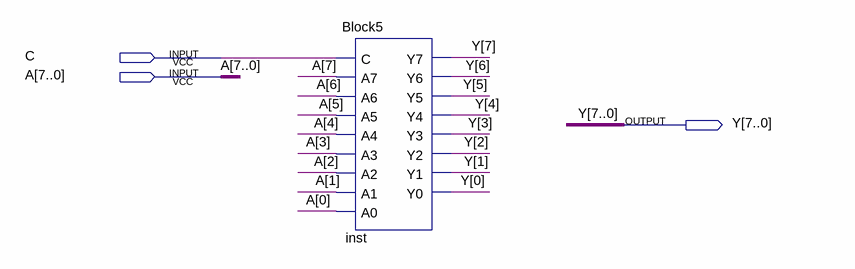
[diagram p0: schematic sheet]
// Quartus schematic TRI-8.bdf as structural Verilog: 1 symbols, 3 pins
module \TRI-8  (
  input  C,
  input  [7:0] A,
  output [7:0] Y
);

  Block5 inst (
    .C(C), .A7(A[7]), .A6(A[6]), .A5(A[5]), .A4(A[4]), .A3(A[3]), .A2(A[2]), .A1(A[1]), .A0(A[0]), .Y7(Y[7]),
    .Y6(Y[6]), .Y5(Y[5]), .Y4(Y[4]), .Y3(Y[3]), .Y2(Y[2]), .Y1(Y[1]), .Y0(Y[0]));
endmodule
